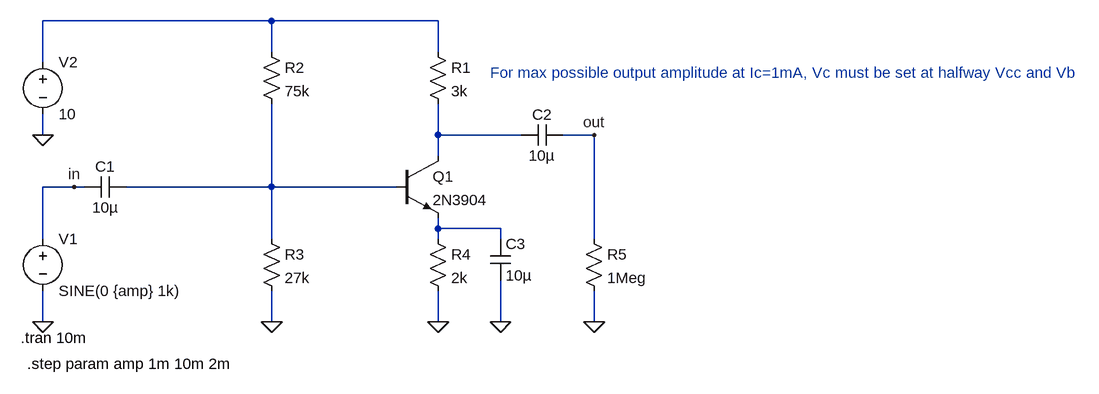
[diagram p0: schematic bjt_amp_bias.asc]
bjt_amp_bias.asc, the LTspice schematic file:
Version 4
SHEET 1 1280 680
WIRE -32 -96 -384 -96
WIRE 224 -96 -32 -96
WIRE -32 -48 -32 -96
WIRE 224 -48 224 -96
WIRE -384 -32 -384 -96
WIRE -384 80 -384 48
WIRE 224 80 224 32
WIRE 352 80 224 80
WIRE 464 80 416 80
WIRE 224 112 224 80
WIRE -336 160 -384 160
WIRE -320 160 -336 160
WIRE -32 160 -32 32
WIRE -32 160 -256 160
WIRE 160 160 -32 160
WIRE 224 224 224 208
WIRE 320 224 224 224
WIRE -384 240 -384 160
WIRE -32 240 -32 160
WIRE 224 240 224 224
WIRE 320 240 320 224
WIRE 464 240 464 80
WIRE -384 368 -384 320
WIRE -32 368 -32 320
WIRE 224 368 224 320
WIRE 320 368 320 304
WIRE 464 368 464 320
FLAG -384 368 0
FLAG -32 368 0
FLAG 224 368 0
FLAG -384 80 0
FLAG 464 368 0
FLAG -336 160 in
FLAG 464 80 out
FLAG 320 368 0
DATAFLAG 304 80 ""
DATAFLAG 64 160 ""
DATAFLAG 320 224 ""
SYMBOL npn 160 112 R0
SYMATTR InstName Q1
SYMATTR Value 2N3904
SYMBOL res 208 -64 R0
SYMATTR InstName R1
SYMATTR Value 3k
SYMBOL res -48 -64 R0
SYMATTR InstName R2
SYMATTR Value 75k
SYMBOL res -48 224 R0
SYMATTR InstName R3
SYMATTR Value 27k
SYMBOL res 208 224 R0
SYMATTR InstName R4
SYMATTR Value 2k
SYMBOL cap -256 144 R90
WINDOW 0 0 32 VBottom 2
WINDOW 3 32 32 VTop 2
SYMATTR InstName C1
SYMATTR Value 10µ
SYMBOL voltage -384 224 R0
WINDOW 123 0 0 Left 0
WINDOW 39 0 0 Left 0
SYMATTR InstName V1
SYMATTR Value SINE(0 {amp} 1k)
SYMBOL voltage -384 -48 R0
SYMATTR InstName V2
SYMATTR Value 10
SYMBOL cap 416 64 R90
WINDOW 0 0 32 VBottom 2
WINDOW 3 32 32 VTop 2
SYMATTR InstName C2
SYMATTR Value 10µ
SYMBOL res 448 224 R0
SYMATTR InstName R5
SYMATTR Value 1Meg
SYMBOL cap 304 240 R0
SYMATTR InstName C3
SYMATTR Value 10µ
TEXT -418 392 Left 2 !.tran 10m
TEXT -408 432 Left 2 !.step param amp 1m 10m 2m
TEXT 304 -16 Left 2 ;For max possible output amplitude at Ic=1mA, Vc must be set at halfway Vcc and Vb

The netlist it stands for:
* bjt_amp_bias.asc
Q1 N002 N003 N004 0 2N3904
R1 N001 N002 3k
R2 N001 N003 75k
R3 N003 0 27k
R4 N004 0 2k
C1 N003 in 10µ
V1 in 0 SINE(0 {amp} 1k)
V2 N001 0 10
C2 out N002 10µ
R5 out 0 1Meg
C3 N004 0 10µ
.model NPN NPN
.model PNP PNP
.lib standard.bjt
.tran 10m
.step param amp 1m 10m 2m
* For max possible output amplitude at Ic=1mA, Vc must be set at halfway Vcc and Vb
.backanno
.end